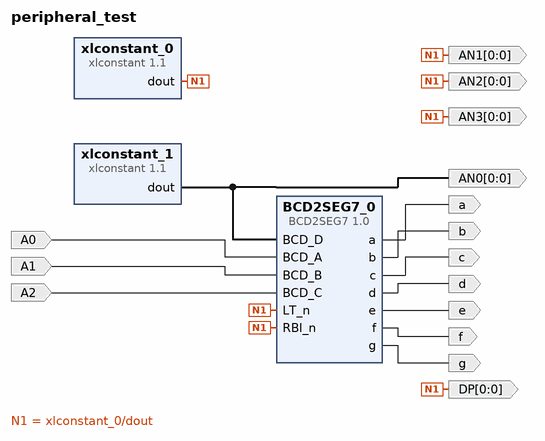
[diagram p0: block diagram of the top level]
# Vivado block design peripheral_test, xc7a35tcpg236-1, Vivado 2016.3
create_bd_design peripheral_test

create_bd_port -dir I A2
create_bd_port -dir I A1
create_bd_port -dir I A0
create_bd_port -dir O a
create_bd_port -dir O b
create_bd_port -dir O c
create_bd_port -dir O d
create_bd_port -dir O e
create_bd_port -dir O f
create_bd_port -dir O g
create_bd_port -dir O -from 0 -to 0 AN0
create_bd_port -dir O -from 0 -to 0 AN1
create_bd_port -dir O -from 0 -to 0 AN2
create_bd_port -dir O -from 0 -to 0 AN3
create_bd_port -dir O -from 0 -to 0 DP

create_bd_cell -type ip -vlnv xilinx.com:XUP:BCD2SEG7:1.0 BCD2SEG7_0
create_bd_cell -type ip -vlnv xilinx.com:ip:xlconstant:1.1 xlconstant_0
create_bd_cell -type ip -vlnv xilinx.com:ip:xlconstant:1.1 xlconstant_1
set_property -dict {CONFIG.CONST_VAL 0} [get_bd_cells xlconstant_1]

# ---- connections ----

connect_bd_net [get_bd_pins xlconstant_0/dout] \
  [get_bd_pins BCD2SEG7_0/LT_n] [get_bd_pins BCD2SEG7_0/RBI_n] [get_bd_ports DP] [get_bd_ports AN1] [get_bd_ports AN2] \
  [get_bd_ports AN3]
connect_bd_net [get_bd_pins xlconstant_1/dout] [get_bd_pins BCD2SEG7_0/BCD_D] [get_bd_ports AN0]
connect_bd_net -net A0_1 [get_bd_ports A0] [get_bd_pins BCD2SEG7_0/BCD_A]
connect_bd_net -net A1_1 [get_bd_ports A1] [get_bd_pins BCD2SEG7_0/BCD_B]
connect_bd_net -net A2_1 [get_bd_ports A2] [get_bd_pins BCD2SEG7_0/BCD_C]
connect_bd_net [get_bd_pins BCD2SEG7_0/a] [get_bd_ports a]
connect_bd_net [get_bd_pins BCD2SEG7_0/b] [get_bd_ports b]
connect_bd_net [get_bd_pins BCD2SEG7_0/c] [get_bd_ports c]
connect_bd_net [get_bd_pins BCD2SEG7_0/d] [get_bd_ports d]
connect_bd_net [get_bd_pins BCD2SEG7_0/e] [get_bd_ports e]
connect_bd_net [get_bd_pins BCD2SEG7_0/f] [get_bd_ports f]
connect_bd_net [get_bd_pins BCD2SEG7_0/g] [get_bd_ports g]

validate_bd_design
save_bd_design
